# Altium schematic sheet Main.SchDoc
size 420 x 297 mm; SheetNumber: 1; SheetTotal: 1
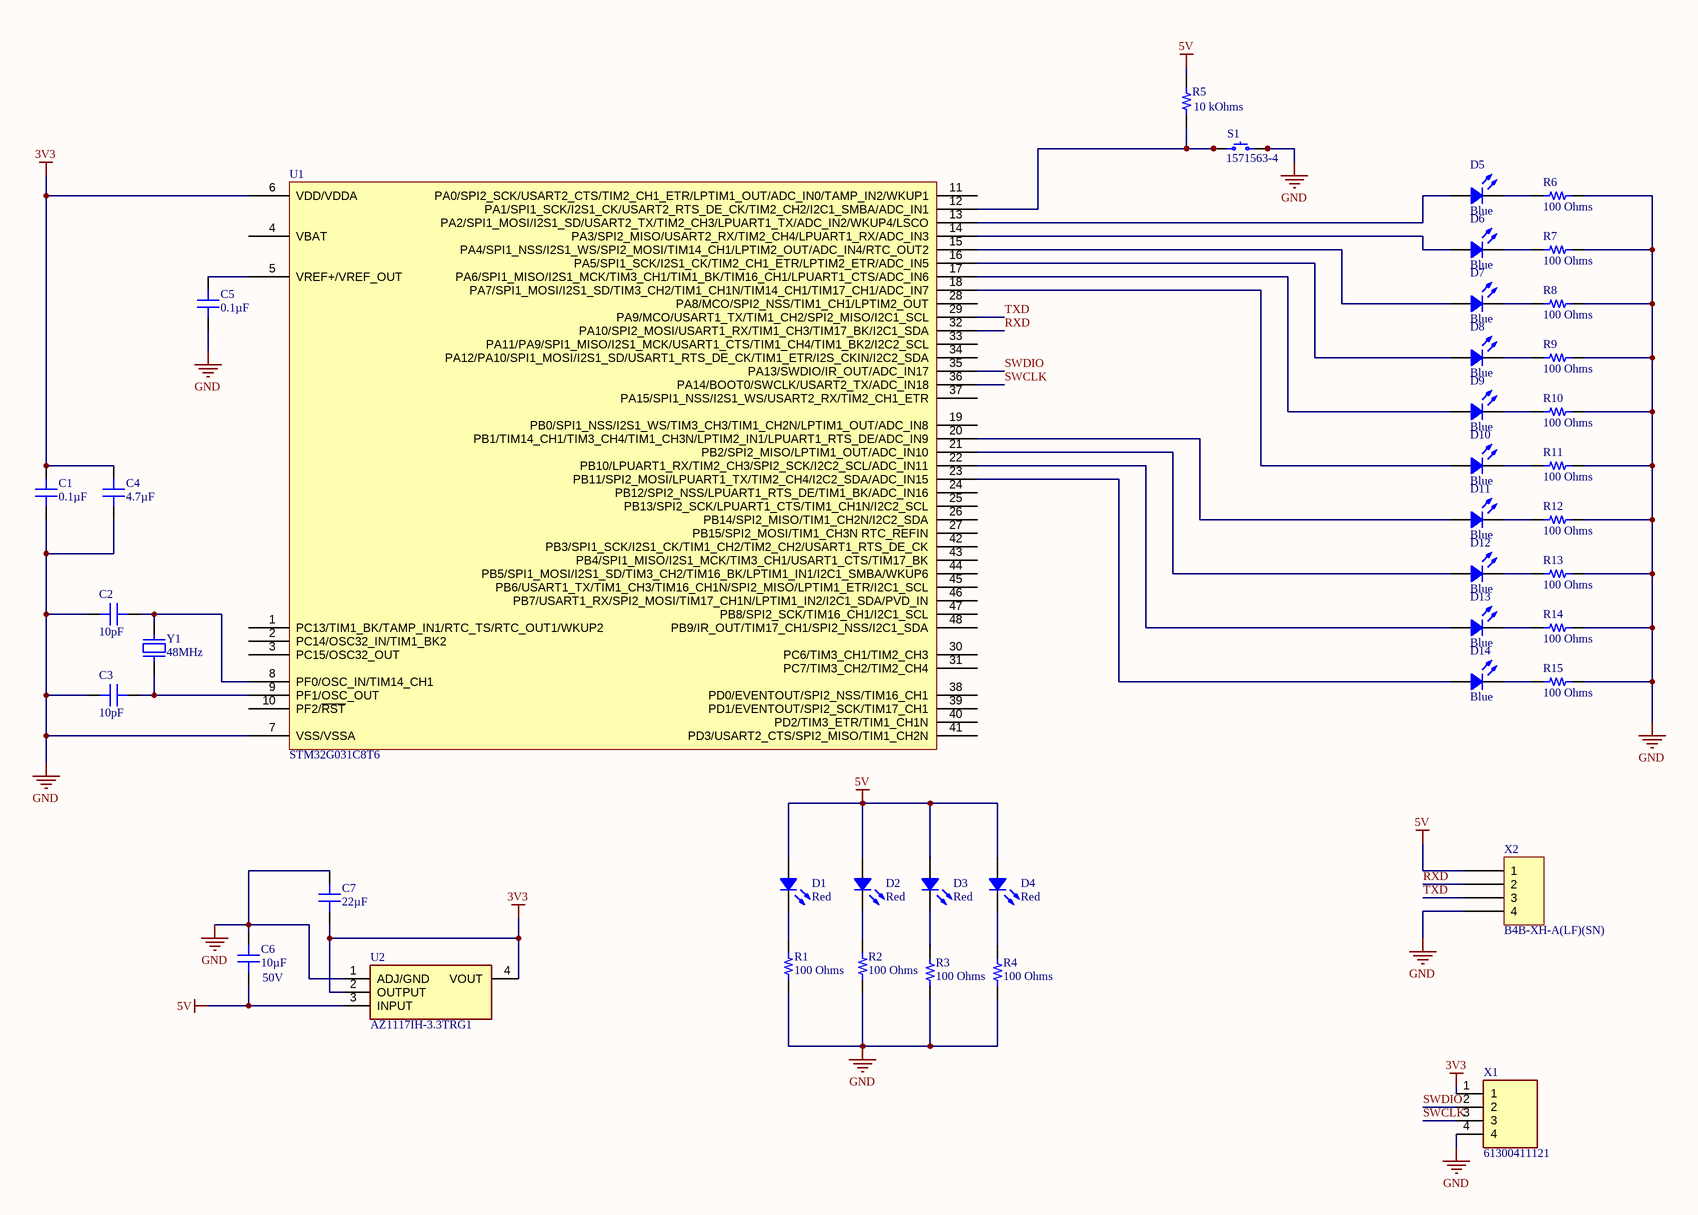
[diagram p0: Main.SchDoc]

## Parts
C1  0.1µF  [CAP 0805_2012]
C2  10pF  [CAP 0603_1608]
C3  10pF  [CAP 0603_1608]
C4  4.7µF  [CAP 0805_2012]
C5  0.1µF  [CAP 0805_2012]
C6  Voltage - Rated: 50V  [CAP 0805_2012]  (hidden comment: 10µF)
C7  22µF  [CAP 0805_2012]
D1  Red  [LED 1206_3216 RED]
D2  Red  [LED 1206_3216 RED]
D3  Red  [LED 1206_3216 RED]
D4  Red  [LED 1206_3216 RED]
D5  Blue  [LED 1206_3216 BLUE]
D6  Blue  [LED 1206_3216 BLUE]
D7  Blue  [LED 1206_3216 BLUE]
D8  Blue  [LED 1206_3216 BLUE]
D9  Blue  [LED 1206_3216 BLUE]
D10  Blue  [LED 1206_3216 BLUE]
D11  Blue  [LED 1206_3216 BLUE]
D12  Blue  [LED 1206_3216 BLUE]
D13  Blue  [LED 1206_3216 BLUE]
D14  Blue  [LED 1206_3216 BLUE]
R1  100 Ohms  [RES 0805_2012]
R2  100 Ohms  [RES 0805_2012]
R3  100 Ohms  [RES 0805_2012]
R4  100 Ohms  [RES 0805_2012]
R5  10 kOhms  [RES 0805_2012]
R6  100 Ohms  [RES 0805_2012]
R7  100 Ohms  [RES 0805_2012]
R8  100 Ohms  [RES 0805_2012]
R9  100 Ohms  [RES 0805_2012]
R10  100 Ohms  [RES 0805_2012]
R11  100 Ohms  [RES 0805_2012]
R12  100 Ohms  [RES 0805_2012]
R13  100 Ohms  [RES 0805_2012]
R14  100 Ohms  [RES 0805_2012]
R15  100 Ohms  [RES 0805_2012]
S1  1571563-4  [TE FSM4JSMA]
U1  STM32G031C8T6  [ST LQFP-48 7X7MM]
U2  AZ1117IH-3.3TRG1  [SOT230P700X180-4N]
X1  61300411121  [HDRV4W95P0X254_1X4_1016X254X854P]
X2  B4B-XH-A(LF)(SN)  [JST XH B4B-XH-A]
Y1  48MHz  [NDK NX5032GA]

## Nets
3V3: C1.2 C4.2 C7.1 U1.6(VDD/VDDA) U2.2(OUTPUT) U2.4(VOUT) X1.1
5V: C6.2 D1.1 D2.1 D3.1 D4.1 R5.2 U2.3(INPUT) X2.1
GND: C1.1 C2.1 C3.1 C4.1 C5.1 C6.1 C7.2 R1.1 R2.1 R3.1 R4.1 R6.1 R7.1 R8.1 R9.1 R10.1 R11.1 R12.1 R13.1 R14.1 R15.1 S1.3 S1.4 U1.7(VSS/VSSA) U2.1(ADJ/GND) X1.4 X2.4
RXD: U1.32(PA10/SPI2_MOSI/USART1_RX/TIM1_CH3/TIM17_BK/I2C1_SDA) X2.2
SWCLK: U1.36(PA14/BOOT0/SWCLK/USART2_TX/ADC_IN18) X1.3
SWDIO: U1.35(PA13/SWDIO/IR_OUT/ADC_IN17) X1.2
TXD: U1.29(PA9/MCO/USART1_TX/TIM1_CH2/SPI2_MISO/I2C1_SCL) X2.3
NetC2_2: C2.2 U1.8(PF0/OSC_IN/TIM14_CH1) Y1.2
NetC3_2: C3.2 U1.9(PF1/OSC_OUT) Y1.1
NetC5_2: C5.2 U1.5(VREF+/VREF_OUT)
NetD1_2: D1.2 R1.2
NetD2_2: D2.2 R2.2
NetD3_2: D3.2 R3.2
NetD4_2: D4.2 R4.2
NetD5_1: D5.1 U1.13(PA2/SPI1_MOSI/I2S1_SD/USART2_TX/TIM2_CH3/LPUART1_TX/ADC_IN2/WKUP4/LSCO)
NetD5_2: D5.2 R6.2
NetD6_1: D6.1 U1.14(PA3/SPI2_MISO/USART2_RX/TIM2_CH4/LPUART1_RX/ADC_IN3)
NetD6_2: D6.2 R7.2
NetD7_1: D7.1 U1.15(PA4/SPI1_NSS/I2S1_WS/SPI2_MOSI/TIM14_CH1/LPTIM2_OUT/ADC_IN4/RTC_OUT2)
NetD7_2: D7.2 R8.2
NetD8_1: D8.1 U1.16(PA5/SPI1_SCK/I2S1_CK/TIM2_CH1_ETR/LPTIM2_ETR/ADC_IN5)
NetD8_2: D8.2 R9.2
NetD9_1: D9.1 U1.17(PA6/SPI1_MISO/I2S1_MCK/TIM3_CH1/TIM1_BK/TIM16_CH1/LPUART1_CTS/ADC_IN6)
NetD9_2: D9.2 R10.2
NetD10_1: D10.1 U1.18(PA7/SPI1_MOSI/I2S1_SD/TIM3_CH2/TIM1_CH1N/TIM14_CH1/TIM17_CH1/ADC_IN7)
NetD10_2: D10.2 R11.2
NetD11_1: D11.1 U1.20(PB1/TIM14_CH1/TIM3_CH4/TIM1_CH3N/LPTIM2_IN1/LPUART1_RTS_DE/ADC_IN9)
NetD11_2: D11.2 R12.2
NetD12_1: D12.1 U1.21(PB2/SPI2_MISO/LPTIM1_OUT/ADC_IN10)
NetD12_2: D12.2 R13.2
NetD13_1: D13.1 U1.22(PB10/LPUART1_RX/TIM2_CH3/SPI2_SCK/I2C2_SCL/ADC_IN11)
NetD13_2: D13.2 R14.2
NetD14_1: D14.1 U1.23(PB11/SPI2_MOSI/LPUART1_TX/TIM2_CH4/I2C2_SDA/ADC_IN15)
NetD14_2: D14.2 R15.2
NetR5_1: R5.1 S1.1 S1.2 U1.12(PA1/SPI1_SCK/I2S1_CK/USART2_RTS_DE_CK/TIM2_CH2/I2C1_SMBA/ADC_IN1)

Not connected (* = marked no-connect by the designer): U1 1(PC13/TIM1_BK/TAMP_IN1/RTC_TS/RTC_OUT1/WKUP2) 2(PC14/OSC32_IN/TIM1_BK2) 3(PC15/OSC32_OUT) 4(VBAT) 10(PF2/~{RST}) 11(PA0/SPI2_SCK/USART2_CTS/TIM2_CH1_ETR/LPTIM1_OUT/ADC_IN0/TAMP_IN2/WKUP1) 19(PB0/SPI1_NSS/I2S1_WS/TIM3_CH3/TIM1_CH2N/LPTIM1_OUT/ADC_IN8) 24(PB12/SPI2_NSS/LPUART1_RTS_DE/TIM1_BK/ADC_IN16) 25(PB13/SPI2_SCK/LPUART1_CTS/TIM1_CH1N/I2C2_SCL) 26(PB14/SPI2_MISO/TIM1_CH2N/I2C2_SDA) 27(PB15/SPI2_MOSI/TIM1_CH3N_RTC_REFIN) 28(PA8/MCO/SPI2_NSS/TIM1_CH1/LPTIM2_OUT) 30(PC6/TIM3_CH1/TIM2_CH3) 31(PC7/TIM3_CH2/TIM2_CH4) 33(PA11/PA9/SPI1_MISO/I2S1_MCK/USART1_CTS/TIM1_CH4/TIM1_BK2/I2C2_SCL) 34(PA12/PA10/SPI1_MOSI/I2S1_SD/USART1_RTS_DE_CK/TIM1_ETR/I2S_CKIN/I2C2_SDA) 37(PA15/SPI1_NSS/I2S1_WS/USART2_RX/TIM2_CH1_ETR) 38(PD0/EVENTOUT/SPI2_NSS/TIM16_CH1) 39(PD1/EVENTOUT/SPI2_SCK/TIM17_CH1) 40(PD2/TIM3_ETR/TIM1_CH1N) 41(PD3/USART2_CTS/SPI2_MISO/TIM1_CH2N) 42(PB3/SPI1_SCK/I2S1_CK/TIM1_CH2/TIM2_CH2/USART1_RTS_DE_CK) 43(PB4/SPI1_MISO/I2S1_MCK/TIM3_CH1/USART1_CTS/TIM17_BK) 44(PB5/SPI1_MOSI/I2S1_SD/TIM3_CH2/TIM16_BK/LPTIM1_IN1/I2C1_SMBA/WKUP6) 45(PB6/USART1_TX/TIM1_CH3/TIM16_CH1N/SPI2_MISO/LPTIM1_ETR/I2C1_SCL) 46(PB7/USART1_RX/SPI2_MOSI/TIM17_CH1N/LPTIM1_IN2/I2C1_SDA/PVD_IN) 47(PB8/SPI2_SCK/TIM16_CH1/I2C1_SCL) 48(PB9/IR_OUT/TIM17_CH1/SPI2_NSS/I2C1_SDA)

## Notes on the sheet
- THIS DOCUMENT AND THE DATA DISCLOSED HEREIN OR
- HEREWITH IS THE PROPERTY OF ALTIUM LIMITED AND MAY
- DWG NO:
- REVISION
- REV:
- DESCRIPTION
- DATE
- APPROVED
- BE FREELY DISTRIBUTED IN WHOLE. NO RIGHTS ARE
- RESERVED OR EXPRESS OR IMPLIED WARANTEE GIVEN.
- ENG:
- APPROVALS
- PROJECT
- DSN:
- CHK:
- REFERENCE DOCUMENTS
- PROJECT REVISION:
- TITLE
- DOCUMENT REVISION:
- DESIGN ITEM:
- BOM:
- FAB DWG:
- PCB DWG:
- ASSY DWG:
- SCALE:
- A3
- SIZE
- CAGE CODE
- FILE NAME
- DWG NO.
- SHEET
- OF
- REV

## Library data of the parts
C1 C5 = C0805C104K9RACAUTO: SMD AUTO X7R, CERAMIC, 0.1 UF, 1; Manufacturer: KEMET; Tolerance: ±10%; Voltage - Rated: 6.3V; Part Number: C0805C104K9RACAUTO; Value: 0.1µF; Applications: Automotive, Bypass, Decoupling; Capacitance: 0.1µF; ComponentLink1Description: Datasheet; ComponentLink1URL: https://api.kemet.com/component-edge/download/datasheet/C0805C104K9RACAUTO.pdf; ComponentLink2Description: DigiKey Link; ComponentLink2URL: http://digikey.com/product-detail/en/kemet/C0805C104K9RACAUTO/399-C0805C104K9RACAUTOCT-ND/10232873; Device Package: 0805 (2012 Metric); LastUpdated: 02.09.2020 01:04:08; Lifecycle Status: Active; Minimum Order: 1; Mounting Type: Surface Mount, MLCC; Operating Temperature: -55°C ~ 125°C; Package / Case: 0805 (2012 Metric); Packaging: TapeAndReel; PartId: 17729; Part Status: Active; Price: 0.05; Ratings: AEC-Q200; Series: SMD Auto X7R; Size / Dimension: 0.079" L x 0.049" W (2.00mm x 1.25mm); Supplier 1: DigiKey; Supplier Part Number 1: 399-C0805C104K9RACAUTOCT-ND; Temperature Coefficient: X7R; Thickness (Max): 0.035" (0.88mm)
C2 C3 = 251R14S100JV4T: CAP CER 10PF 250V C0G/NP0 0603; Manufacturer: Johanson Technology Inc.; Temperature Coefficient: C0G, NP0; Tolerance: ±5%; Part Number: 251R14S100JV4T; Value: 10pF; Applications: RF, Microwave, High Frequency; Capacitance: 10pF; ComponentLink1Description: Datasheet; ComponentLink1URL: https://www.johansontechnology.com/downloads/catalog/johanson-technology-multi-layer-high-q-capacitors.pdf; ComponentLink2Description: DigiKey Link; ComponentLink2URL: http://digikey.com/product-detail/en/johanson-technology-inc/251R14S100JV4T/712-1308-1-ND/1786770; Device Package: 0603 (1608 Metric); Features: High Q, Low Loss, Ultra Low ESR; LastUpdated: 02.09.2020 01:03:32; Lifecycle Status: Active; Minimum Order: 1; Mounting Type: Surface Mount, MLCC; Operating Temperature: -55°C ~ 125°C; Package / Case: 0603 (1608 Metric); Packaging: TapeAndReel; PartId: 4123; Part Status: Active; Price: 0.07; Series: S; Size / Dimension: 0.062" L x 0.032" W (1.57mm x 0.81mm); Supplier 1: DigiKey; Supplier Part Number 1: 712-1308-1-ND; Thickness (Max): 0.035" (0.89mm); Voltage - Rated: 250V
C4 = C2012JB1H475K125AB: CAP CER 4.7UF 50V JB 0805; Manufacturer: TDK Corporation; Tolerance: ±10%; Part Number: C2012JB1H475K125AB; Value: 4.7µF; Applications: General Purpose; Capacitance: 4.7µF; ComponentLink1Description: Datasheet; ComponentLink1URL: https://product.tdk.com/info/en/catalog/datasheets/mlcc_commercial_general_en.pdf?ref_disty=digikey; ComponentLink2Description: DigiKey Link; ComponentLink2URL: http://digikey.com/product-detail/en/tdk-corporation/C2012JB1H475K125AB/445-11510-1-ND/3953176; Device Package: 0805 (2012 Metric); LastUpdated: 02.09.2020 01:04:16; Lifecycle Status: Active; Minimum Order: 1; Mounting Type: Surface Mount, MLCC; Operating Temperature: -25°C ~ 85°C; Package / Case: 0805 (2012 Metric); Packaging: TapeAndReel; PartId: 15333; Part Status: Active; Price: 0.18; Series: C; Size / Dimension: 0.079" L x 0.049" W (2.00mm x 1.25mm); Supplier 1: DigiKey; Supplier Part Number 1: 445-11510-1-ND; Temperature Coefficient: JB; Thickness (Max): 0.057" (1.45mm); Voltage - Rated: 50V; Features: Low ESL
C6 = GRM21BR61H106KE43L: 0805 (2012MM) X5R (EIA) 50VDC 10; Manufacturer: Murata Electronics; Tolerance: ±10%; Part Number: GRM21BR61H106KE43L; Value: 10µF; Applications: General Purpose; Capacitance: 10µF; ComponentLink1Description: Datasheet; ComponentLink1URL: https://search.murata.co.jp/Ceramy/image/img/A01X/G101/ENG/GRM21BR61H106KE43-01A.pdf; ComponentLink2Description: DigiKey Link; ComponentLink2URL: http://digikey.com/product-detail/en/murata-electronics/GRM21BR61H106KE43L/490-18663-1-ND/10326328; Device Package: 0805 (2012 Metric); LastUpdated: 02.09.2020 01:04:31; Lifecycle Status: Active; Minimum Order: 1; Mounting Type: Surface Mount, MLCC; Operating Temperature: -55°C ~ 85°C; Package / Case: 0805 (2012 Metric); Packaging: TapeAndReel; PartId: 8559; Part Status: Active; Price: 0.10; Series: GRM; Size / Dimension: 0.079" L x 0.049" W (2.00mm x 1.25mm); Supplier 1: DigiKey; Supplier Part Number 1: 490-18663-1-ND; Temperature Coefficient: X5R; Thickness (Max): 0.057" (1.45mm)
C7 = GRM21BR60J226ME39K: CAP CER 22UF 6.3V X5R 0805; Manufacturer: Murata Electronics; Tolerance: ±20%; Part Number: GRM21BR60J226ME39K; Value: 22µF; Applications: General Purpose; Capacitance: 22µF; ComponentLink1Description: Datasheet; ComponentLink1URL: https://search.murata.co.jp/Ceramy/image/img/A01X/G101/ENG/GRM21BR60J226ME39-01.pdf; ComponentLink2Description: DigiKey Link; ComponentLink2URL: http://digikey.com/product-detail/en/murata-electronics/GRM21BR60J226ME39K/490-6471-1-ND/3845668; Device Package: 0805 (2012 Metric); LastUpdated: 02.09.2020 01:04:25; Lifecycle Status: Active; Minimum Order: 1; Mounting Type: Surface Mount, MLCC; Operating Temperature: -55°C ~ 85°C; Package / Case: 0805 (2012 Metric); Packaging: TapeAndReel; PartId: 11540; Part Status: Active; Price: 0.07; Series: GRM; Size / Dimension: 0.079" L x 0.049" W (2.00mm x 1.25mm); Supplier 1: DigiKey; Supplier Part Number 1: 490-6471-1-ND; Temperature Coefficient: X5R; Thickness (Max): 0.053" (1.35mm); Voltage - Rated: 6.3V
D1-D4 = 150120RS75000: LED RED CLEAR 1206 SMD; Manufacturer: Würth Elektronik; Configuration: Standard; Current - Test: 20mA; Lens Color: Colorless; Lens Size: 2.00mm x 1.60mm; Lens Style: Rectangle with Flat Top; Millicandela Rating: 150mcd; Viewing Angle: 140°; Voltage - Forward (Vf) (Typ): 2V; Wavelength - Dominant: 625nm; Wavelength - Peak: 630nm; Part Number: 150120RS75000; Color: Red; ComponentLink1Description: Datasheet; ComponentLink1URL: https://katalog.we-online.de/led/datasheet/150120RS75000.pdf; ComponentLink2Description: DigiKey Link; ComponentLink2URL: http://digikey.com/product-detail/en/w-rth-elektronik/150120RS75000/732-4991-1-ND/4489937; Device Package: 1206 (3216 Metric); Height (Max): 0.69mm; LastUpdated: 02.09.2020 01:21:09; Lens Transparency: Clear; Lifecycle Status: Active; Minimum Order: 1; Mounting Type: Surface Mount; Package / Case: 1206 (3216 Metric); Packaging: TapeAndReel; PartId: 226; Part Status: Active; Price: 0.15; Series: WL-SMCW; Size / Dimension: 3.20mm L x 1.60mm W; Supplier 1: DigiKey; Supplier Part Number 1: 732-4991-1-ND; Supplier Device Package: 1206; Value: Red
D5-D14 = 150120BS75000: LED BLUE CLEAR 1206 SMD; Manufacturer: Würth Elektronik; Configuration: Standard; Current - Test: 20mA; Lens Color: Colorless; Lens Size: 2.00mm x 1.60mm; Lens Style: Rectangle with Flat Top; Millicandela Rating: 145mcd; Viewing Angle: 140°; Voltage - Forward (Vf) (Typ): 3.2V; Wavelength - Dominant: 470nm; Wavelength - Peak: 465nm; Part Number: 150120BS75000; Color: Blue; ComponentLink1Description: Datasheet; ComponentLink1URL: https://katalog.we-online.de/led/datasheet/150120BS75000.pdf; ComponentLink2Description: DigiKey Link; ComponentLink2URL: http://digikey.com/product-detail/en/w-rth-elektronik/150120BS75000/732-4989-1-ND/4489931; Device Package: 1206 (3216 Metric); Height (Max): 0.69mm; LastUpdated: 02.09.2020 01:20:33; Lens Transparency: Clear; Lifecycle Status: Active; Minimum Order: 1; Mounting Type: Surface Mount; Package / Case: 1206 (3216 Metric); Packaging: TapeAndReel; PartId: 748; Part Status: Active; Price: 0.15; Series: WL-SMCW; Size / Dimension: 3.20mm L x 1.60mm W; Supplier 1: DigiKey; Supplier Part Number 1: 732-4989-1-ND; Supplier Device Package: 1206; Value: Blue
R1-R4 R6-R15 = RC0805FR-07100RP: RES SMD 100 OHM 1% 1/8W 0805; Manufacturer: Yageo; Power (Watts): 0.125W, 1/8W; Temperature Coefficient: ±150ppm/°C; Part Number: RC0805FR-07100RP; Value: 100 Ohms; ComponentLink1Description: Datasheet; ComponentLink1URL: http://www.yageo.com/NewPortal/yageodocoutput?fileName=/pdf/R-Chip/PYu-RC_51_RoHS_P_0.pdf; ComponentLink2Description: DigiKey Link; ComponentLink2URL: http://digikey.com/product-detail/en/yageo/RC0805FR-07100RP/YAG1318CT-ND/4935431; Composition: Thick Film; Device Package: 0805 (2012 Metric); Features: Moisture Resistant; Height - Seated (Max): 0.024" (0.60mm); LastUpdated: 02.09.2020 01:15:22; Lifecycle Status: Active; Minimum Order: 1; Number of Terminations: 2; Operating Temperature: -55°C ~ 155°C; Package / Case: 0805 (2012 Metric); Packaging: TapeAndReel; PartId: 28669; Part Status: Active; Price: 0.01; Resistance: 100 Ohms; Series: RC-P Lead Free; Size / Dimension: 0.079" L x 0.049" W (2.00mm x 1.25mm); Supplier 1: DigiKey; Supplier Part Number 1: YAG1318CT-ND; Supplier Device Package: 0805; Tolerance: ±1%
R5 = RT0805DRD0710KL: RES SMD 10K OHM 0.5% 1/8W 0805; Manufacturer: Yageo; Power (Watts): 0.125W, 1/8W; Temperature Coefficient: ±25ppm/°C; Part Number: RT0805DRD0710KL; Value: 10 kOhms; ComponentLink1Description: Datasheet; ComponentLink1URL: https://www.yageo.com/upload/media/product/productsearch/datasheet/rchip/PYu-RT_1-to-0.01_RoHS_L_11.pdf; ComponentLink2Description: DigiKey Link; ComponentLink2URL: http://digikey.com/product-detail/en/yageo/RT0805DRD0710KL/311-2699-1-ND/6129118; Composition: Thin Film; Device Package: 0805 (2012 Metric); Height - Seated (Max): 0.024" (0.60mm); LastUpdated: 02.09.2020 01:15:24; Lifecycle Status: Active; Minimum Order: 1; Number of Terminations: 2; Operating Temperature: -55°C ~ 155°C; Package / Case: 0805 (2012 Metric); Packaging: TapeAndReel; PartId: 27797; Part Status: Active; Price: 0.03; Resistance: 10 kOhms; Series: RT; Size / Dimension: 0.079" L x 0.049" W (2.00mm x 1.25mm); Supplier 1: DigiKey; Supplier Part Number 1: 311-2699-1-ND; Supplier Device Package: 0805; Tolerance: ±0.5%
S1 = 1571563-4: SWITCH TACTILE SPST-NO 0.05A 24V; Manufacturer: TE Connectivity ALCOSWITCH Switches; Actuator Height off PCB, Vertical: 5.00mm; Actuator Orientation: Top Actuated; Actuator Type: Standard; Contact Rating @ Voltage: 0.05A @ 24VDC; Illumination: Non-Illuminated; Operating Force: 260gf; Outline: 6.00mm x 6.00mm; Switch Function: Off-Mom; Part Number: 1571563-4; Circuit: SPST-NO; ComponentLink1Description: Datasheet; ComponentLink1URL: https://www.te.com/commerce/DocumentDelivery/DDEController?Action=srchrtrv&DocNm=1308111-1_SWITCHES_CORE_PROGRAM_CATALOG&DocType=CS&DocLang=English; ComponentLink2Description: DigiKey Link; ComponentLink2URL: http://digikey.com/product-detail/en/te-connectivity-alcoswitch-switches/1571563-4/450-2055-1-ND/4569745; LastUpdated: 02.09.2020 01:27:07; Lifecycle Status: Active; Minimum Order: 1; Mounting Type: Surface Mount; Operating Temperature: -35°C ~ 85°C; Packaging: TapeAndReel; Part Status: Active; Price: 0.17; Series: FSMJSMA; Supplier 1: DigiKey; Supplier Part Number 1: 450-2055-1-ND; Termination Style: Gull Wing
U1 = STM32G031C8T6: MAINSTREAM ARM CORTEX-M0+ MCU WI; Manufacturer: STMicroelectronics; Connectivity: I²C, IrDA, LINbus, SPI, UART/USART; Core Processor: ARM® Cortex®-M0+; Core Size: 32-Bit; Data Converters: A/D 19x12b; Number of I/O: 44; Oscillator Type: Internal; Peripherals: Brown-out Detect/Reset, DMA, I²S, POR, PWM, WDT; Program Memory Size: 64KB (64K x 8); Program Memory Type: FLASH; RAM Size: 8K x 8; Speed: 64MHz; Voltage - Supply (Vcc/Vdd): 1.7V ~ 3.6V; Part Number: STM32G031C8T6; ComponentLink1Description: Datasheet; ComponentLink1URL: https://www.st.com/resource/en/datasheet/stm32g031c6.pdf; ComponentLink2Description: DigiKey Link; ComponentLink2URL: http://digikey.com/product-detail/en/stmicroelectronics/STM32G031C8T6/497-19556-ND/10300269; LastUpdated: 02.09.2020 01:30:59; Lifecycle Status: Active; Minimum Order: 1; Mounting Type: Surface Mount; Operating Temperature: -40°C ~ 85°C (TA); Package / Case: 48-LQFP; Packaging: Tray; PartId: 216; Part Status: Active; Price: 2.24; Series: STM32G0; Supplier 1: DigiKey; Supplier Part Number 1: 497-19556-ND; Supplier Device Package: 48-LQFP (7x7)
U2 = AZ1117IH-3.3TRG1: Integrated Circuit; Manufacturer_Name: Diodes Inc.; Datasheet Link: http://www.mouser.com/ds/2/115/AZ1117-776390.pdf; Height: 1.8mm; Manufacturer_Part_Number: AZ1117IH-3.3TRG1; Mouser Part Number: 621-AZ1117IH-3.3TRG1; Mouser Price/Stock: https://www.mouser.co.uk/ProductDetail/Diodes-Incorporated/AZ1117IH-33TRG1?qs=cpo3%2FpBou2jnS4SxLgAVoA%3D%3D; Arrow Part Number: AZ1117IH-3.3TRG1; Arrow Price/Stock: https://www.arrow.com/en/products/az1117ih-3.3trg1/diodes-incorporated?region=nac
X1 = 61300411121: Connector; Manufacturer_Name: Wurth Elektronik; Datasheet Link: http://katalog.we-online.de/em/datasheet/6130xx11121.pdf; Height: 8.54mm; Manufacturer_Part_Number: 61300411121; Mouser Part Number: 710-61300411121; Mouser Price/Stock: https://www.mouser.co.uk/ProductDetail/Wurth-Elektronik/61300411121?qs=PhR8RmCirEYQcLLqXD8rAA%3D%3D
X2 = B4B-XH-A(LF)(SN): CONN HEADER VERT 4POS 2.5MM; Manufacturer: JST Sales America Inc.; Contact Length - Post: 0.134" (3.40mm); Current Rating (Amps): 3A; Material Flammability Rating: UL94 V-0; Number of Positions: 4; Number of Positions Loaded: All; Pitch - Mating: 0.098" (2.50mm); Shrouding: Shrouded - 4 Wall; Style: Board to Cable/Wire; Voltage Rating: 250V; Part Number: B4B-XH-A(LF)(SN); ComponentLink1Description: Datasheet; ComponentLink1URL: http://www.jst-mfg.com/product/pdf/eng/eXH.pdf; ComponentLink2Description: DigiKey Link; ComponentLink2URL: http://digikey.com/product-detail/en/jst-sales-america-inc/B4B-XH-A-LF-SN/455-2249-ND/1651047; Connector Type: Header; Contact Finish - Mating: Tin; Contact Finish - Post: Tin; Contact Material: Brass; Contact Shape: Square; Contact Type: Male Pin; Fastening Type: Detent Lock; Insulation Color: Natural; Insulation Height: 0.276" (7.00mm); Insulation Material: Polyamide (PA66), Nylon 6/6; LastUpdated: 12.01.2020 23:46:34; Lifecycle Status: Active; Minimum Order: 1; Mounting Type: Through Hole; Number of Rows: 1; Operating Temperature: -25°C ~ 85°C; Packaging: Bulk; PartId: 69; Part Status: Active; Price: 0.21; Series: XH; Supplier 1: DigiKey; Supplier Part Number 1: 455-2249-ND; Termination: Press-Fit, Solder
Y1 = NX5032GA-48.000000MHZ-LN-CD-1: CRYSTAL 48.0000MHZ 8PF SMD; Manufacturer: NDK America, Inc.; ESR (Equivalent Series Resistance): 50 Ohms; Frequency Stability: ±50ppm; Operating Mode: Fundamental; Part Number: NX5032GA-48.000000MHZ-LN-CD-1; ComponentLink1Description: Datasheet; ComponentLink1URL: //media.digikey.com/pdf/Data%20Sheets/NDK%20PDFs/NX5032GA.pdf; ComponentLink2Description: DigiKey Link; ComponentLink2URL: http://digikey.com/product-detail/en/ndk-america-inc/NX5032GA-48.000000MHZ-LN-CD-1/644-1046-1-ND/1128918; Frequency: 48MHz; Frequency Tolerance: ±50ppm; Height - Seated (Max): 0.059" (1.50mm); LastUpdated: 02.09.2020 01:22:00; Lifecycle Status: Active; Load Capacitance: 8pF; Minimum Order: 1; Mounting Type: Surface Mount; Operating Temperature: -10°C ~ 70°C; Package / Case: 2-SMD, No Lead; Packaging: TapeAndReel; PartId: 626; Part Status: Active; Price: 0.32; Series: NX5032GA; Size / Dimension: 0.197" L x 0.126" W (5.00mm x 3.20mm); Supplier 1: DigiKey; Supplier Part Number 1: 644-1046-1-ND; Type: MHz Crystal; Value: 48MHz